# Altium schematic sheet ADC_part1.SchDoc
size A4
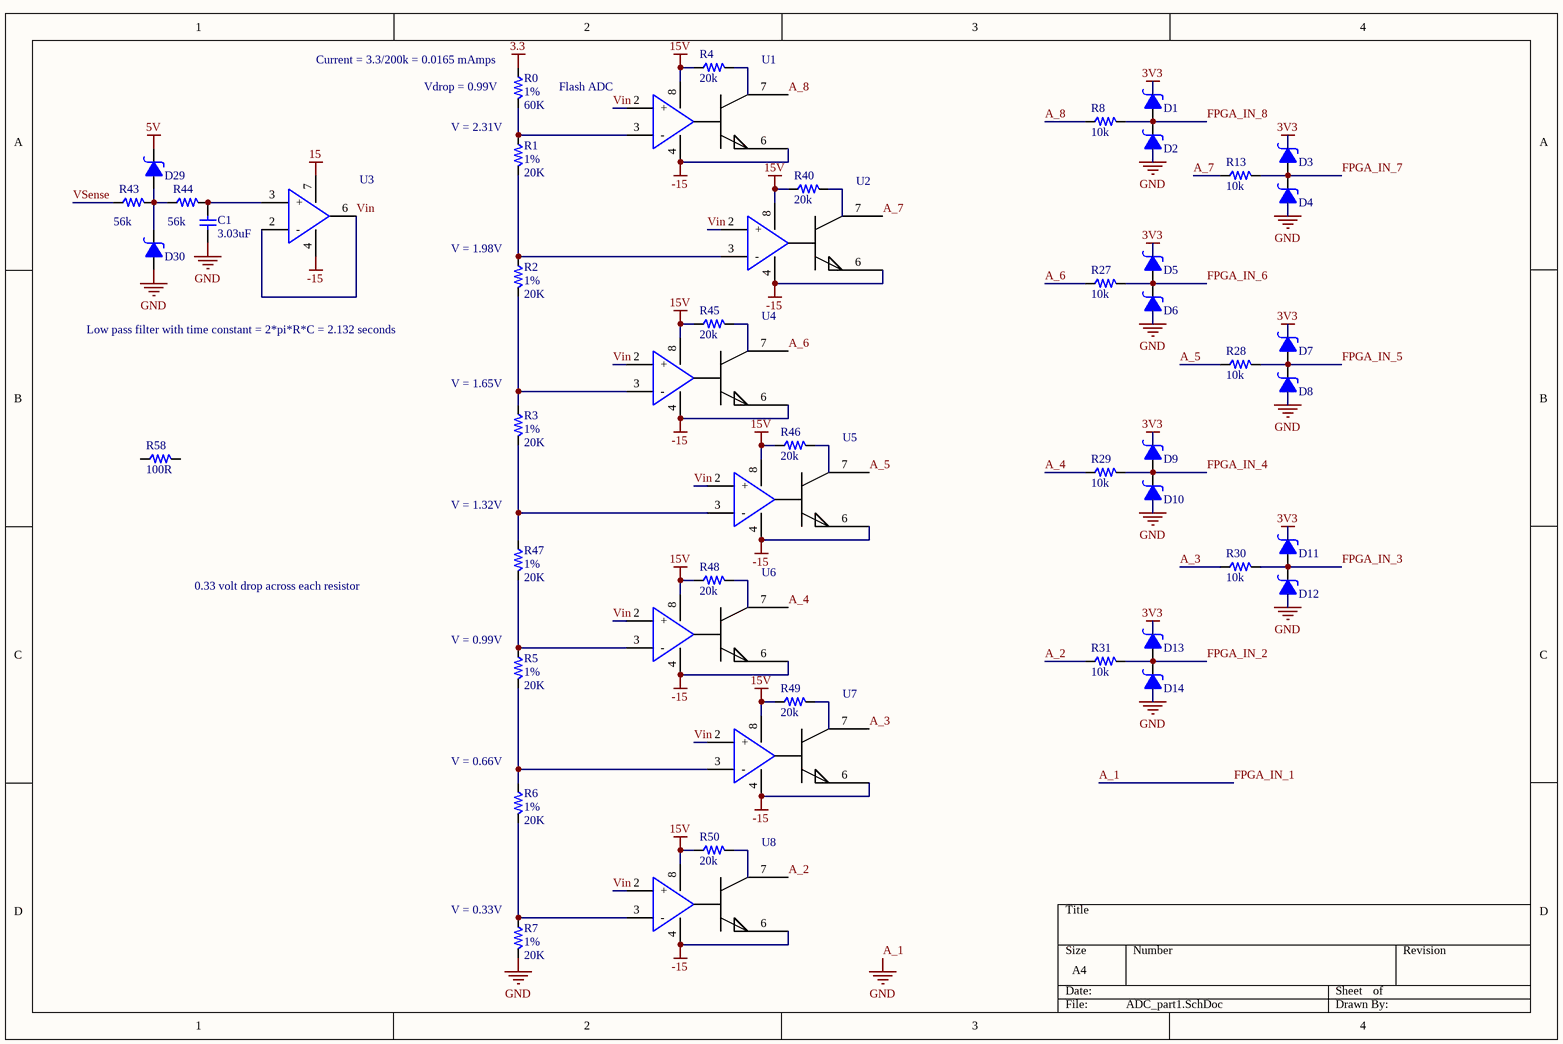
[diagram p0: ADC_part1.SchDoc]

## Parts
C1  value 3.03uF  [PCB_GENERIC_SMD_0603]  (hidden comment: C060-0001U-00)
D1  ONSEMI_MBRM110LT1G  [ON Semi Schottky Diode - MBRM110LT1G]  (value not drawn)
D2  ONSEMI_MBRM110LT1G  [ON Semi Schottky Diode - MBRM110LT1G]  (value not drawn)
D3  ONSEMI_MBRM110LT1G  [ON Semi Schottky Diode - MBRM110LT1G]  (value not drawn)
D4  ONSEMI_MBRM110LT1G  [ON Semi Schottky Diode - MBRM110LT1G]  (value not drawn)
D5  ONSEMI_MBRM110LT1G  [ON Semi Schottky Diode - MBRM110LT1G]  (value not drawn)
D6  ONSEMI_MBRM110LT1G  [ON Semi Schottky Diode - MBRM110LT1G]  (value not drawn)
D7  ONSEMI_MBRM110LT1G  [ON Semi Schottky Diode - MBRM110LT1G]  (value not drawn)
D8  ONSEMI_MBRM110LT1G  [ON Semi Schottky Diode - MBRM110LT1G]  (value not drawn)
D9  ONSEMI_MBRM110LT1G  [ON Semi Schottky Diode - MBRM110LT1G]  (value not drawn)
D10  ONSEMI_MBRM110LT1G  [ON Semi Schottky Diode - MBRM110LT1G]  (value not drawn)
D11  ONSEMI_MBRM110LT1G  [ON Semi Schottky Diode - MBRM110LT1G]  (value not drawn)
D12  ONSEMI_MBRM110LT1G  [ON Semi Schottky Diode - MBRM110LT1G]  (value not drawn)
D13  ONSEMI_MBRM110LT1G  [ON Semi Schottky Diode - MBRM110LT1G]  (value not drawn)
D14  ONSEMI_MBRM110LT1G  [ON Semi Schottky Diode - MBRM110LT1G]  (value not drawn)
D29  ONSEMI_MBRM110LT1G  [ON Semi Schottky Diode - MBRM110LT1G]  (value not drawn)
D30  ONSEMI_MBRM110LT1G  [ON Semi Schottky Diode - MBRM110LT1G]  (value not drawn)
R0  value 60K  Tolerance: 1%  [PCB_GENERIC_SMD_0603]  (hidden comment: R060-00103-01)
R1  value 20K  Tolerance: 1%  [PCB_GENERIC_SMD_0603]  (hidden comment: R060-00103-01)
R2  value 20K  Tolerance: 1%  [PCB_GENERIC_SMD_0603]  (hidden comment: R060-00103-01)
R3  value 20K  Tolerance: 1%  [PCB_GENERIC_SMD_0603]  (hidden comment: R060-00103-01)
R4  value 20k  [PCB_GENERIC_SMD_0603]  (hidden comment: R060-00101-05)
R5  value 20K  Tolerance: 1%  [PCB_GENERIC_SMD_0603]  (hidden comment: R060-00103-01)
R6  value 20K  Tolerance: 1%  [PCB_GENERIC_SMD_0603]  (hidden comment: R060-00103-01)
R7  value 20K  Tolerance: 1%  [PCB_GENERIC_SMD_0603]  (hidden comment: R060-00103-01)
R8  value 10k  [PCB_GENERIC_SMD_0603]  (hidden comment: R060-00101-05)
R13  value 10k  [PCB_GENERIC_SMD_0603]  (hidden comment: R060-00101-05)
R27  value 10k  [PCB_GENERIC_SMD_0603]  (hidden comment: R060-00101-05)
R28  value 10k  [PCB_GENERIC_SMD_0603]  (hidden comment: R060-00101-05)
R29  value 10k  [PCB_GENERIC_SMD_0603]  (hidden comment: R060-00101-05)
R30  value 10k  [PCB_GENERIC_SMD_0603]  (hidden comment: R060-00101-05)
R31  value 10k  [PCB_GENERIC_SMD_0603]  (hidden comment: R060-00101-05)
R40  value 20k  [PCB_GENERIC_SMD_0603]  (hidden comment: R060-00101-05)
R43  value 56k  [PCB_GENERIC_SMD_0603]  (hidden comment: R060-00101-05)
R44  value 56k  [PCB_GENERIC_SMD_0603]  (hidden comment: R060-00101-05)
R45  value 20k  [PCB_GENERIC_SMD_0603]  (hidden comment: R060-00101-05)
R46  value 20k  [PCB_GENERIC_SMD_0603]  (hidden comment: R060-00101-05)
R47  value 20K  Tolerance: 1%  [PCB_GENERIC_SMD_0603]  (hidden comment: R060-00103-01)
R48  value 20k  [PCB_GENERIC_SMD_0603]  (hidden comment: R060-00101-05)
R49  value 20k  [PCB_GENERIC_SMD_0603]  (hidden comment: R060-00101-05)
R50  value 20k  [PCB_GENERIC_SMD_0603]  (hidden comment: R060-00101-05)
R58  value 100R  [PCB_GENERIC_SMD_0603]  (hidden comment: R060-00101-05)
U1  AP331A  [SOT95P285X130-5N]  (value not drawn)
U2  AP331A  [SOT95P285X130-5N]  (value not drawn)
U3  AP331A  [SOT95P285X130-5N]  (value not drawn)
U4  AP331A  [SOT95P285X130-5N]  (value not drawn)
U5  AP331A  [SOT95P285X130-5N]  (value not drawn)
U6  AP331A  [SOT95P285X130-5N]  (value not drawn)
U7  AP331A  [SOT95P285X130-5N]  (value not drawn)
U8  AP331A  [SOT95P285X130-5N]  (value not drawn)

## Nets
3.3: R0.1
3V3: D1.1 D3.1 D5.1 D7.1 D9.1 D11.1 D13.1
5V: D29.1
15: U3.7(VCC)
15V: R4.1 R40.1 R45.1 R46.1 R48.1 R49.1 R50.1 U1.8(VCC) U2.8(VCC) U4.8(VCC) U5.8(VCC) U6.8(VCC) U7.8(VCC) U8.8(VCC)
-15: U1.4(GND) U1.6 U2.4(GND) U2.6 U3.4(GND) U4.4(GND) U4.6 U5.4(GND) U5.6 U6.4(GND) U6.6 U7.4(GND) U7.6 U8.4(GND) U8.6
A_1: C1.1 D2.2 D4.2 D6.2 D8.2 D10.2 D12.2 D14.2 D30.2 R7.2  [also labelled FPGA_IN_1, GND]
A_2: R31.1 U8.7
A_3: R30.1 U7.7
A_4: R29.1 U6.7
A_5: R28.1 U5.7
A_6: R27.1 U4.7
A_7: R13.1 U2.7
A_8: R8.1 U1.7
FPGA_IN_2: D13.2 D14.1 R31.2
FPGA_IN_3: D11.2 D12.1 R30.2
FPGA_IN_4: D9.2 D10.1 R29.2
FPGA_IN_5: D7.2 D8.1 R28.2
FPGA_IN_6: D5.2 D6.1 R27.2
FPGA_IN_7: D3.2 D4.1 R13.2
FPGA_IN_8: D1.2 D2.1 R8.2
Vin: U1.2(+) U2.2(+) U3.2(-) U3.6 U4.2(+) U5.2(+) U6.2(+) U7.2(+) U8.2(+)
VSense: R43.1
NetC1_2: C1.2 R44.2 U3.3(+)
NetD29_2: D29.2 D30.1 R43.2 R44.1
NetR0_2: R0.2 R1.1 U1.3(-)
NetR1_2: R1.2 R2.1 U2.3(-)
NetR2_2: R2.2 R3.1 U4.3(-)
NetR3_2: R3.2 R47.1 U5.3(-)
NetR5_1: R5.1 R47.2 U6.3(-)
NetR5_2: R5.2 R6.1 U7.3(-)
NetR6_2: R6.2 R7.1 U8.3(-)

Not connected (* = marked no-connect by the designer): R4 2; R40 2; R45 2; R46 2; R48 2; R49 2; R50 2; R58 1 2

## Notes on the sheet
- (near R0) Current = 3.3/200k = 0.0165 mAmps
- (near R0) Vdrop = 0.99V
- Flash ADC
- V = 2.31V
- (near R2) V = 1.98V
- Low pass filter with time constant = 2*pi*R*C = 2.132 seconds
- (near R3) V = 1.65V
- (near R47) V = 1.32V
- 0.33 volt drop across each resistor
- (near R5) V = 0.99V
- (near R6) V = 0.66V
- (near R7) V = 0.33V

## Library data of the parts
C1 = C060-0001U-00: CAP CER 0603 1uF 16V X5R 20%; Tolerance: 20%; Voltage: 16V; Package: 0603
D1-D14 D29 D30 = ONSEMI_MBRM110LT1G: DIODE SCHOTTKY 10V 1A; Supplier 1: Digi-Key; Supplier Part Number 1: MBRM110LT1GOSDKR-ND
R0-R3 R5-R7 R47 = R060-00103-01: RES 0603 10K 1% 100mW; Power: 100mW; Package: 0603
R4 R8 R13 R27-R31 R40 R43-R46 R48-R50 R58 = R060-00101-05: RES 0603 100ohm 5% 63mW; Tolerance: 5%; Power: 63mW; Package: 0603
U1-U8 = AP331A: Single Channel Comparator, Open Drain, SC-74A/SOT-753; Supplier 1: Digikey; Supplier Part Number 1: AP331AWGDICT-ND